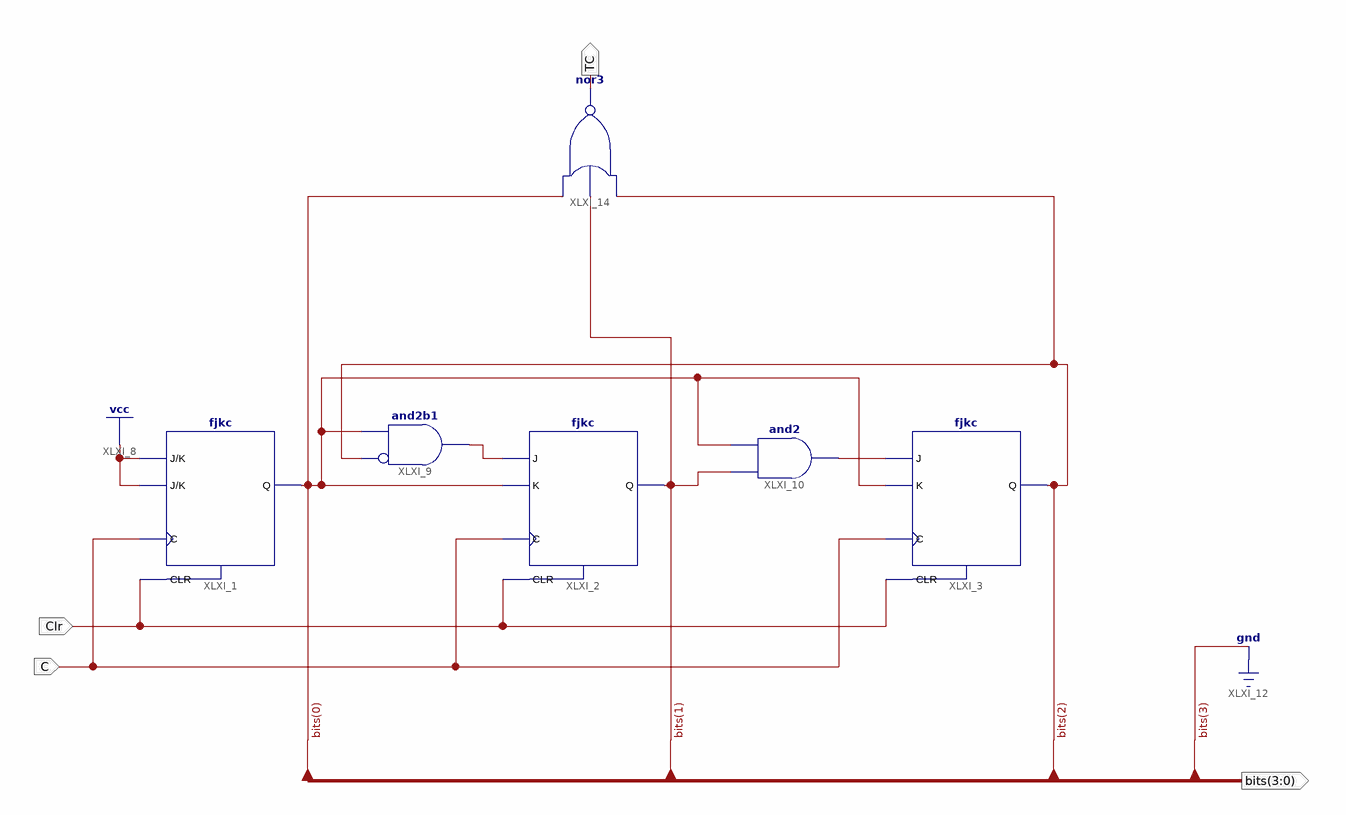
[diagram p0: schematic sheet 1]
// Xilinx ISE schematic counter0_5.sch (spartan6) as structural Verilog: 6 symbols, 4 ports
module counter0_5 (
  input  C,
  input  Clr,
  output [3:0] bits,
  output TC
);

  wire XLXN_9, XLXN_16;

  fjkc XLXI_1 (.C(C), .CLR(Clr), .J(1'b1), .K(1'b1), .Q(bits[0]));
  fjkc XLXI_2 (.C(C), .CLR(Clr), .J(XLXN_9), .K(bits[0]), .Q(bits[1]));
  fjkc XLXI_3 (.C(C), .CLR(Clr), .J(XLXN_16), .K(bits[0]), .Q(bits[2]));
  and XLXI_9 (XLXN_9, ~bits[2], bits[0]);  // and2b1
  and XLXI_10 (XLXN_16, bits[1], bits[0]);
  nor XLXI_14 (TC, bits[2], bits[1], bits[0]);

  assign bits[3] = 1'b0;
endmodule
